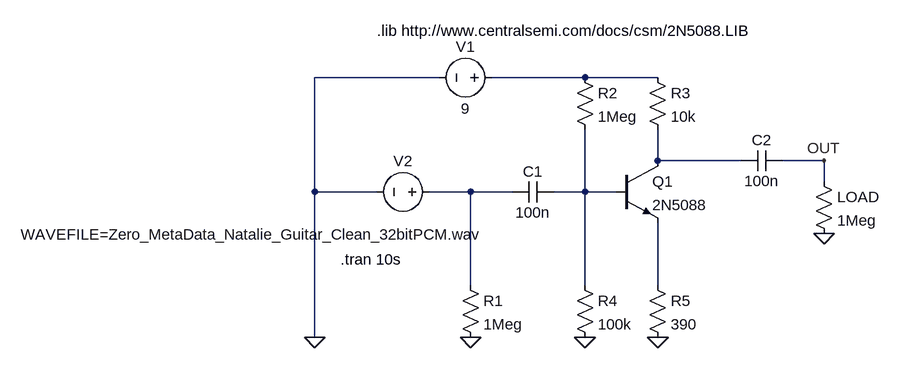
[diagram p0: schematic LBP1.asc]
LBP1.asc, the LTspice schematic file:
Version 4
SHEET 1 1488 680
WIRE -288 -224 -480 -224
WIRE -64 -224 -208 -224
WIRE 48 -224 -64 -224
WIRE 48 -96 48 -144
WIRE 176 -96 48 -96
WIRE 304 -96 240 -96
WIRE 304 -64 304 -96
WIRE -480 -48 -480 -224
WIRE -384 -48 -480 -48
WIRE -240 -48 -304 -48
WIRE -176 -48 -240 -48
WIRE -64 -48 -64 -144
WIRE -64 -48 -112 -48
WIRE -16 -48 -64 -48
WIRE -240 96 -240 -48
WIRE -64 96 -64 -48
WIRE 48 96 48 0
WIRE -480 176 -480 -48
FLAG -240 176 0
FLAG -64 176 0
FLAG 48 176 0
FLAG -480 176 0
FLAG 304 16 0
FLAG 304 -96 OUT
SYMBOL npn -16 -96 R0
SYMATTR InstName Q1
SYMATTR Value 2N5088
SYMBOL res -256 80 R0
SYMATTR InstName R1
SYMATTR Value 1Meg
SYMBOL res -80 -240 R0
SYMATTR InstName R2
SYMATTR Value 1Meg
SYMBOL res 32 -240 R0
SYMATTR InstName R3
SYMATTR Value 10k
SYMBOL res -80 80 R0
SYMATTR InstName R4
SYMATTR Value 100k
SYMBOL res 32 80 R0
SYMATTR InstName R5
SYMATTR Value 390
SYMBOL cap -112 -64 R90
WINDOW 0 0 32 VBottom 2
WINDOW 3 32 32 VTop 2
SYMATTR InstName C1
SYMATTR Value 100n
SYMBOL cap 240 -112 R90
WINDOW 0 0 32 VBottom 2
WINDOW 3 32 32 VTop 2
SYMATTR InstName C2
SYMATTR Value 100n
SYMBOL voltage -192 -224 R90
WINDOW 0 -32 56 VBottom 2
WINDOW 3 32 56 VTop 2
WINDOW 123 0 0 Left 0
WINDOW 39 0 0 Left 0
SYMATTR InstName V1
SYMATTR Value 9
SYMBOL voltage -288 -48 R90
WINDOW 0 -32 56 VBottom 2
WINDOW 3 81 286 VBottom 2
SYMATTR InstName V2
SYMATTR Value WAVEFILE=Zero_MetaData_Natalie_Guitar_Clean_32bitPCM.wav
SYMBOL res 288 -80 R0
SYMATTR InstName LOAD
SYMATTR Value 1Meg
TEXT -384 -296 Left 2 !.lib http://www.centralsemi.com/docs/csm/2N5088.LIB
TEXT -440 56 Left 2 !.tran 10s

The netlist it stands for:
* LBP1.asc
Q1 N002 N004 N005 0 2N5088
R1 N003 0 1Meg
R2 N001 N004 1Meg
R3 N001 N002 10k
R4 N004 0 100k
R5 N005 0 390
C1 N004 N003 100n
C2 OUT N002 100n
V1 N001 0 9
V2 N003 0 WAVEFILE=Zero_MetaData_Natalie_Guitar_Clean_32bitPCM.wav
R§LOAD OUT 0 1Meg
.model NPN NPN
.model PNP PNP
.lib standard.bjt
.lib http://www.centralsemi.com/docs/csm/2N5088.LIB
.tran 10s
.backanno
.end